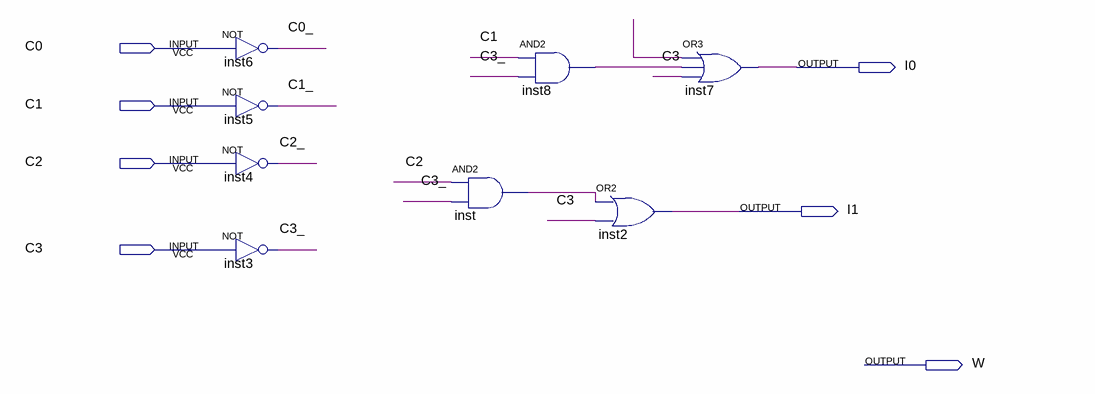
[diagram p0: schematic sheet]
// Quartus schematic pCD4.bdf as structural Verilog: 8 symbols, 7 pins
module pCD4 (
  input  C0,
  input  C1,
  input  C2,
  input  C3,
  output I0,
  output I1,
  output W
);

  wire C0_, C1_, C2_, C3_, inst8_out, inst_out, undriven;

  not inst6 (C0_, C0);
  not inst5 (C1_, C1);
  not inst4 (C2_, C2);
  not inst3 (C3_, C3);
  and inst (inst_out, C2, C3_);
  and inst8 (inst8_out, C1, C3_);
  or inst2 (I1, inst_out, C3);
  or inst7 (I0, undriven, inst8_out, C3);
endmodule
